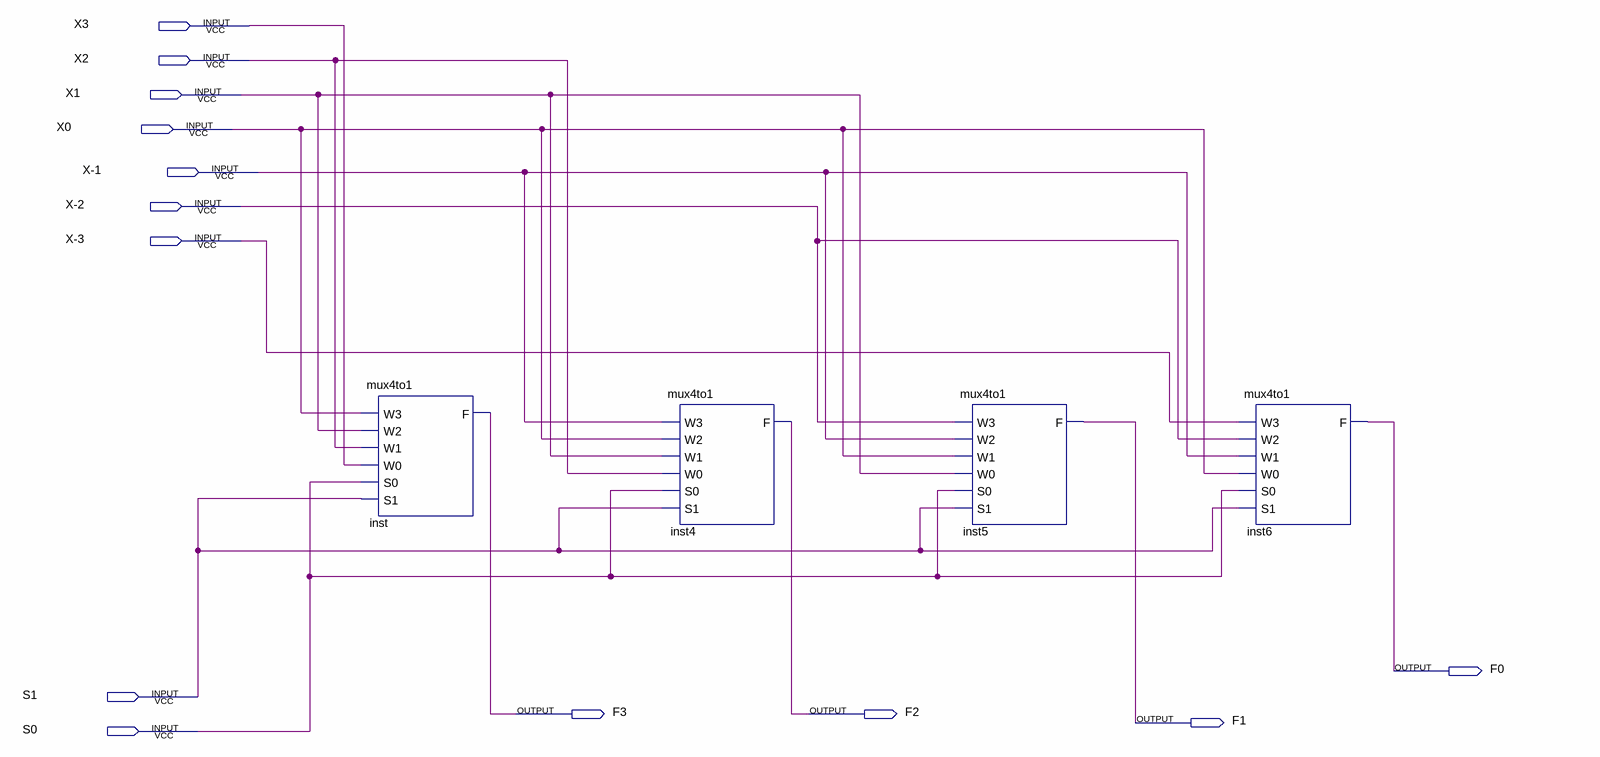
[diagram p0: schematic sheet]
// Quartus schematic leftShift.bdf as structural Verilog: 4 symbols, 13 pins
module leftShift (
  input  X3,
  input  X2,
  input  X1,
  input  X0,
  input  \X-1 ,
  input  \X-2 ,
  input  \X-3 ,
  input  S1,
  input  S0,
  output F0,
  output F3,
  output F2,
  output F1
);

  mux4to1 inst (.W3(X0), .W2(X1), .W1(X2), .W0(X3), .S0(S0), .S1(S1), .F(F3));
  mux4to1 inst4 (.W3(\X-1 ), .W2(X0), .W1(X1), .W0(X2), .S0(S0), .S1(S1), .F(F2));
  mux4to1 inst5 (.W3(\X-2 ), .W2(\X-1 ), .W1(X0), .W0(X1), .S0(S0), .S1(S1), .F(F1));
  mux4to1 inst6 (.W3(\X-3 ), .W2(\X-2 ), .W1(\X-1 ), .W0(X0), .S0(S0), .S1(S1), .F(F0));
endmodule
